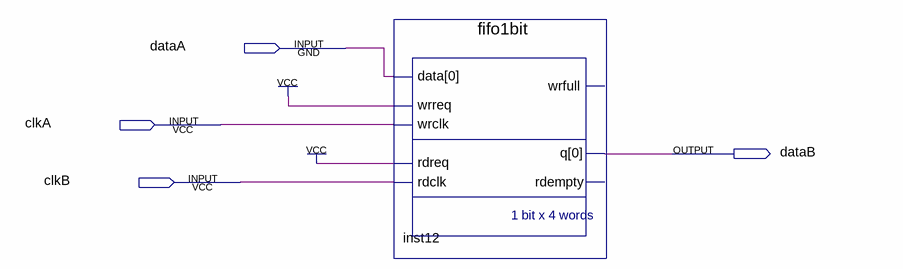
[diagram p0: schematic sheet]
// Quartus schematic cdc_1bit_fifo.bdf as structural Verilog: 1 symbols, 4 pins
module cdc_1bit_fifo (
  input  dataA,
  input  clkA,
  input  clkB,
  output dataB
);

  fifo1bit inst12 (
    .data(dataA), .wrreq(1'b1), .wrclk(clkA), .rdreq(1'b1), .rdclk(clkB), .q(dataB));  // open: wrfull, rdempty
endmodule
